# EAGLE design sensor-hub-lr (EAGLE 9.6.2)
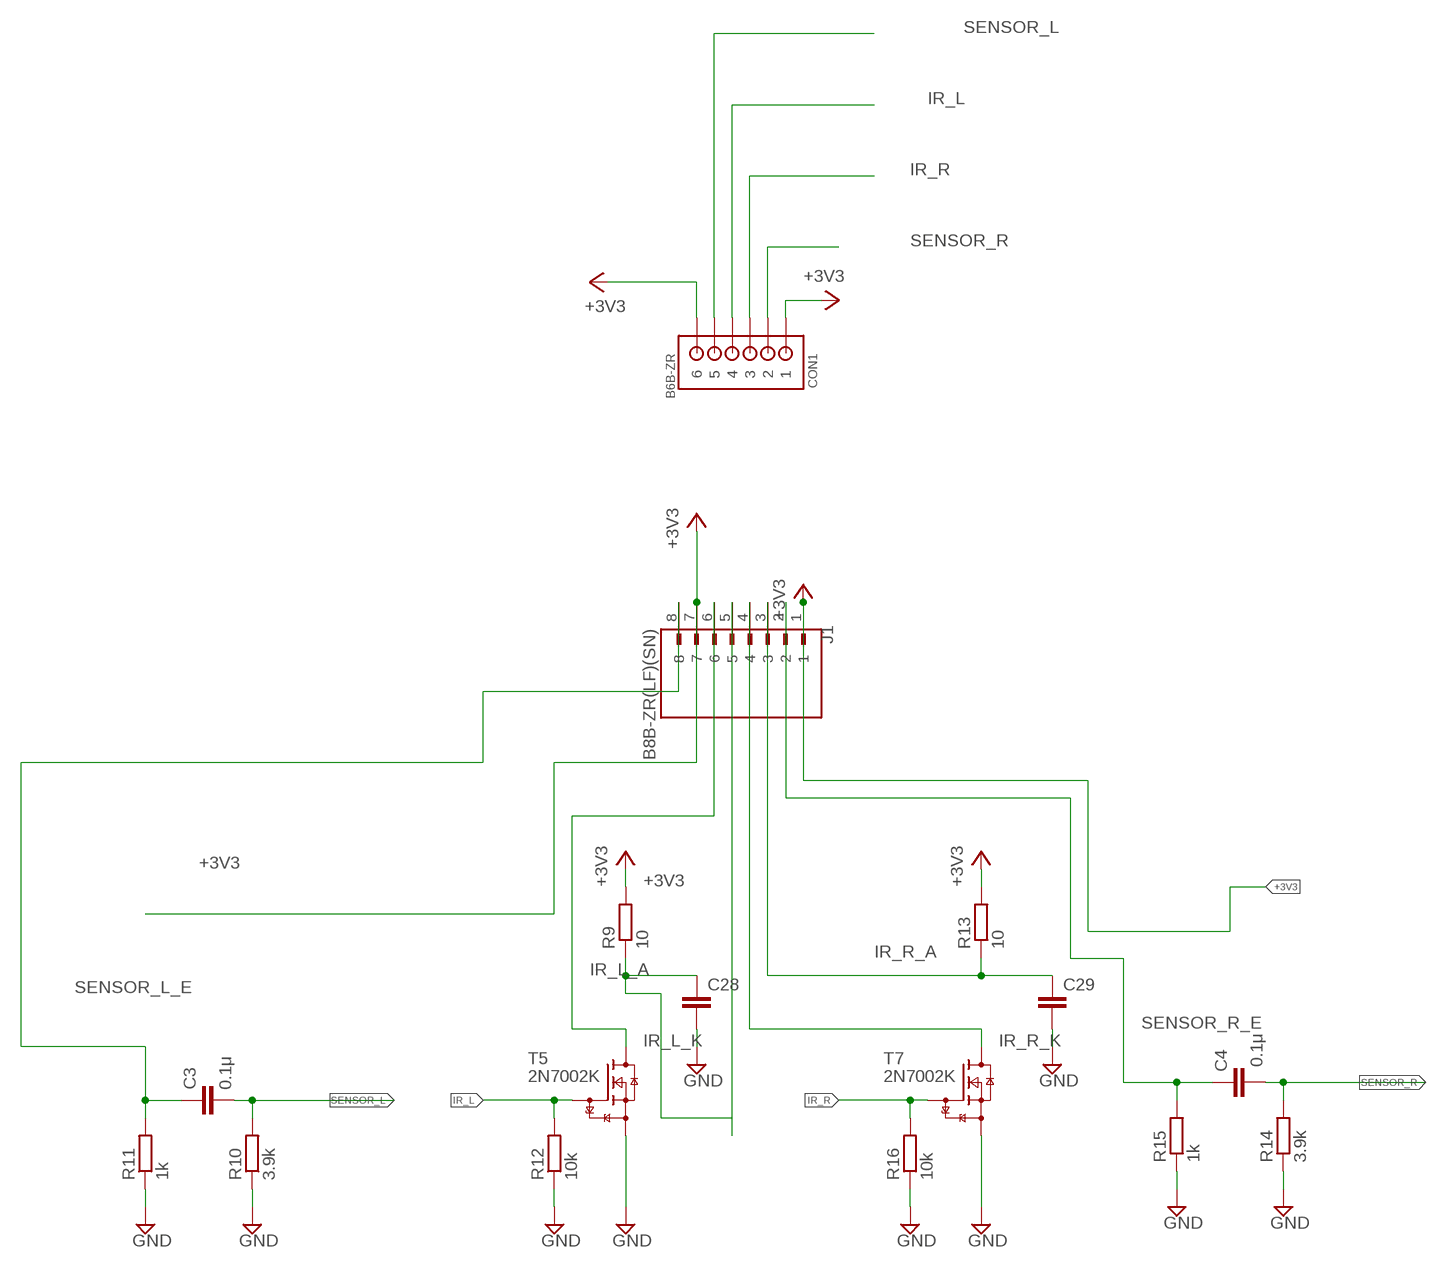
[diagram p0: schematic, sheet 1]

## Parts
C3  0.1μ  C-EUC0603  [C0603]
C4  0.1μ  C-EUC0603  [C0603]
C28  C-EUC1206  [C1206]
C29  C-EUC1206  [C1206]
CON1  B6B-ZR  [B6B-ZR]
J1  B8B-ZR(LF)(SN)  [JST_B8B-ZR(LF)(SN)]
R9  10  R-EU_R0603  [R0603]
R10  3.9k  R-EU_R0603  [R0603]
R11  1k  R-EU_R0603  [R0603]
R12  10k  R-EU_R0603  [R0603]
R13  10  R-EU_R0603  [R0603]
R14  3.9k  R-EU_R0603  [R0603]
R15  1k  R-EU_R0603  [R0603]
R16  10k  R-EU_R0603  [R0603]
T5  2N7002K  [SOT23]
T7  2N7002K  [SOT23]

## Nets
+3V3: CON1.1 CON1.6 J1.1 J1.7 R9.2 R13.2
GND [motor]: C28.2 C29.2 R10.1 R11.1 R12.1 R14.1 R15.1 R16.1 T5.2(S) T7.2(S)
IR_L: CON1.4 R12.2 T5.1(G)
IR_L_A: C28.1 J1.5 R9.1
IR_L_K: J1.6 T5.3(D)
IR_R: CON1.3 R16.2 T7.1(G)
IR_R_A: C29.1 J1.3 R13.1
IR_R_K: J1.4 T7.3(D)
SENSOR_L: C3.2 CON1.5 R10.2
SENSOR_L_E: C3.1 J1.8 R11.2
SENSOR_R: C4.2 CON1.2 R14.2
SENSOR_R_E: C4.1 J1.2 R15.2

## Library data of the parts
C3 C4 C28 C29 = rcl:C-EU: CAPACITOR, European symbol; SPICEPREFIX: C
CON1 = zh:B6B-ZR: JST-ZH Connector 6 pol, 1.5mm pitch Package: B6B-ZR Source: http://www.jst-mfg.com/product/pdf/eng/eZH.pdf
J1 = B8B-ZR_LF__SN_:B8B-ZR(LF)(SN): Check availability <https://pricing.snapeda.com/parts/B8B-ZR%20%28LF%29%28SN%29/JST/view-part?ref=eda>; AVAILABILITY: In Stock; CHECK_PRICES: https://www.snapeda.com/parts/B8B-ZR%20(LF)(SN)/JST/view-part/?ref=eda; DESCRIPTION: Wire-To-Board Connector, Top Entry, ZH Series, Through Hole, Header, 8, 1.5 mm, Tin Plated Contacts RoHS Compliant: Yes; MF: JST; MP: B8B-ZR (LF)(SN); PACKAGE: None; PRICE: None; SNAPEDA_LINK: https://www.snapeda.com/parts/B8B-ZR%20(LF)(SN)/JST/view-part/?ref=snap
R9-R16 = rcl:R-EU_: RESISTOR, European symbol; SPICEPREFIX: R
T5 T7 = nxp_60:2N7002K: N-channel TrenchMOS FET N-channel enhancement mode Field-Effect Transistor (FET) in a plastic package using TrenchMOS technology. AAL Eindhoven MK

## Net classes
1 power: width 0.152 mm, clearance 0.205 mm to class 0, clearance 0.205 mm
2 motor: width 0.152 mm, clearance 0.205 mm to class 0, clearance 0.205 mm to class 1, clearance 0.205 mm

## Board
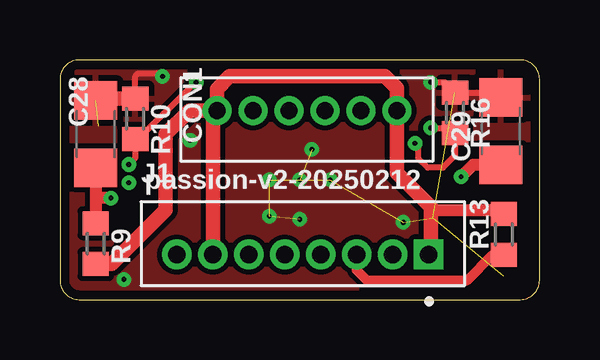
[diagram p1: board, top side]
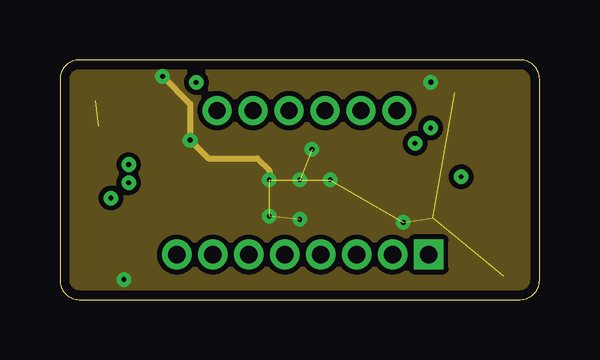
[diagram p2: board, inner layer Route2]
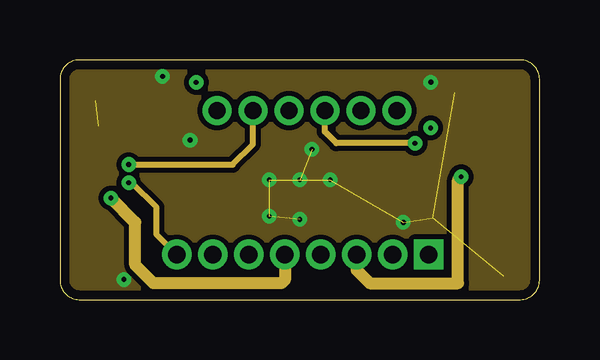
[diagram p3: board, inner layer Route15]
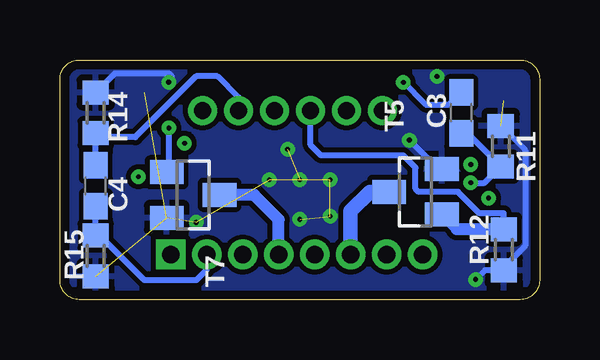
[diagram p4: board, bottom side, seen from below]

Size 20 x 10 mm. Coordinates in mm from the lower left corner, seen from the top.
Outline: 19.2,0 arc90 20,0.8 20,9.2 arc90 19.2,10 0.8,10 arc90 0,9.2 0,0.8 arc90 0.8,0 19.2,0
Copper layers (1+2*15+16): Top 0.035mm / dielectric 1.5mm / Route2 0.035mm / dielectric 0.15mm / Route15 0.035mm / dielectric 0.2mm / Bottom 0.035mm
Design rules "default *": minimum track width 6mil, minimum drill 0.2mm, track to track 6mil, track to pad 6mil, pad to pad 6mil, via to via 6mil, smd to smd 6mil, copper to edge 15mil, drill to drill 6mil, minimum pad ring 10mil, minimum via ring 8mil, stop-mask expansion 4mil, vias tented up to drill 100mil, thermal gap 10mil

### Footprints (pad centres in the part's own frame; a part is rotated, then mirrored left to right if it is on the bottom)
C0603 = smd 1.1 x 1: 1 -0.85,0; 2 0.85,0
C1206 = smd 1.6 x 1.8: 1 -1.4,0; 2 1.4,0
B6B-ZR = drill 0.7: 1 9,-1.3; 2 7.5,-1.3; 3 6,-1.3; 4 4.5,-1.3; 5 3,-1.3; 6 1.5,-1.3
JST_B8B-ZR(LF)(SN) = drill 0.73 square: 1 5.25,-0.45 | drill 0.73: 2 3.75,-0.45; 3 2.25,-0.45; 4 0.75,-0.45; 5 -0.75,-0.45; 6 -2.25,-0.45; 7 -3.75,-0.45; 8 -5.25,-0.45
R0603 = smd 1 x 1.1: 1 -0.85,0; 2 0.85,0
SOT23 = smd 1 x 1.4: 1 -0.95,-1.1; 2 0.95,-1.1; 3 0,1.1

### Placement (x,y rotation side)
C3  3.27,7.79 90 bottom
C4  18.51,4.75 90 bottom
C28  1.49,6.91 90 top
C29  18.38,7.03 90 top
CON1  5.05,9.19 0 top
J1  10.13,2.33 0 top
R9  1.49,2.33 270 top
R10  3.14,7.54 270 top
R11  1.62,6.4 270 bottom
R12  1.49,2.08 90 bottom
R13  18.51,2.71 90 top
R14  18.51,7.79 270 bottom
R15  18.51,1.83 90 bottom
R16  16.48,7.79 270 top
T5  5.17,4.49 90 bottom
T7  14.45,4.37 270 bottom

### Tracks (layer width: path | path; a pad name or v marks a point on that pad's centre or on a via)
+3V3
  Top 0.508: 15.46,3.73 18.34,3.73 R13.2
  Top 0.61: CON1.6 6.55,8.78 7.08,9.31 13.56,9.31 14.05,8.82 CON1.1 14.05,5.27 15.46,3.86 15.46,3.73 15.46,1.97 J1.1 | CON1.6 5.4,7.89 4.41,6.91 4.41,3.73 2.17,1.48 R9.2 | J1.7 6.38,7.72 CON1.6
GND  (via drill 0.2)  (10 unrouted)
  Top 0.254: v15.47,9.07 16.05,9.07 R16.1 18.17,8.64 C29.2 | R10.1 3.14,9.32 3.27,9.45 4.15,9.45 v4.28,9.32
  Top 0.61: 1.58,8.39 C28.2 | 1.58,8.39 R10.1 | 1.62,8.35 1.58,8.39
  Route2 0.254: v8.73,5 8.73,5.38 8.22,5.89 6.19,5.89 v5.43,6.65 5.43,8.16 v4.28,9.32
  Bottom 0.254: R14.1 17.71,9.45 15.46,9.45 15.33,9.32 15.33,9.2 v15.47,9.07 | T5.2 4.22,5.44 v5.43,6.65 | R12.1 1.62,1.23 | 1.62,1.23 2.28,1.23 v2.67,0.84 | R11.1 0.6,6.23 0.6,2.25 1.62,1.23
  other vias: 10,5 14.32,3.22 11.27,5 10,3.35 8.73,3.48 10.51,6.27
  pour Route2: 12.54,13.89 -5.24,13.89 -5.24,-0.08 -1.43,-3.89 20.16,-3.89 25.24,1.19 25.24,11.35 22.7,13.89
  pour Route15: 10,16.43 -6.51,16.43 -10.32,12.62 -10.32,-5.16 -9.05,-6.43 30.32,-6.43 32.86,-3.89 32.86,17.7 31.59,16.43
  pour Top: 8.73,12.62 -2.7,12.62 -2.7,-0.08 -1.43,-1.35 20.16,-1.35 21.43,-0.08 21.43,11.35 20.16,12.62
  pour Bottom: 10,21.51 -2.7,21.51 -14.13,10.08 -14.13,-3.89 -7.78,-10.24 37.94,-10.24 39.21,-8.97 39.21,17.7 35.4,21.51
IR_L
  Bottom 0.254: R12.2 1.49,3.6 2.51,3.6 3.4,4.49 5.05,4.49 5.17,4.62 5.17,5.51 5.68,6.02 9.11,6.02 9.55,6.45 CON1.4
  Bottom 0.406: 3.46,2.93 T5.1
  Bottom 0.508: R12.2 3.46,2.93
IR_L_A  (via drill 0.2)
  Top 0.508: 1.49,4.24 R9.1 | v2.13,4.24 1.49,4.24 | C28.1 1.49,4.24
  Route15 0.508: J1.5 9.38,0.82 9.24,0.68 3.9,0.68 3.14,1.44 3.14,3.22 v2.13,4.24
IR_L_K
  Bottom 0.61: J1.6 7.88,3.69 7.08,4.49 T5.3
IR_R  (via drill 0.2)
  Top 0.254: v15.46,7.16 16.26,7.16 R16.2 16.48,6.02 15.97,5.51 15.33,5.51 14.95,5.89 14.95,6.38 v14.81,6.52
  Route15 0.254: v14.81,6.52 11.52,6.52 11.05,7 CON1.3
  Bottom 0.254: v15.46,7.16 15.46,5.4 T7.1
IR_R_A  (via drill 0.2)
  Top 0.406: J1.3 12.38,1.23 12.79,0.81 16.98,0.81 18.04,1.86 R13.1
  Top 0.508: v16.73,5.13 17.24,5.63 C29.1
  Route15 0.508: J1.3 12.38,1.23 12.92,0.68 16.6,0.68 16.6,5 v16.73,5.13
IR_R_K
  Bottom 0.508: J1.4 10.88,3.34 11.9,4.37 T7.3
SENSOR_L  (via drill 0.2)
  Top 0.254: v5.68,9.06 5.55,8.94 5.52,8.94 3.27,6.69 R10.2 3.14,5.91 v2.87,5.63
  Route15 0.254: v2.87,5.63 7.21,5.63 8.05,6.48 CON1.5
  Bottom 0.254: v5.68,9.06 4.75,8.14 3.78,8.14 C3.2
SENSOR_L_E  (via drill 0.2)
  Route15 0.254: J1.8 4.03,2.73 4.03,3.86 3.01,4.87 v2.87,4.87
  Bottom 0.254: v2.87,4.87 2.29,4.87 R11.2 3.01,6.94 C3.1
SENSOR_R
  Bottom 0.254: C4.2 18.51,6.78 | 18.51,6.78 R14.2 | CON1.2 12.55,8.44 13.43,9.32 14.32,9.32 16.86,6.78 18.51,6.78
SENSOR_R_E
  Bottom 0.254: J1.2 13.88,1.25 14.32,0.81 16.48,0.81 18.34,2.67 R15.2 C4.1

### Text on the board
tPlace: passion-v2-20250212